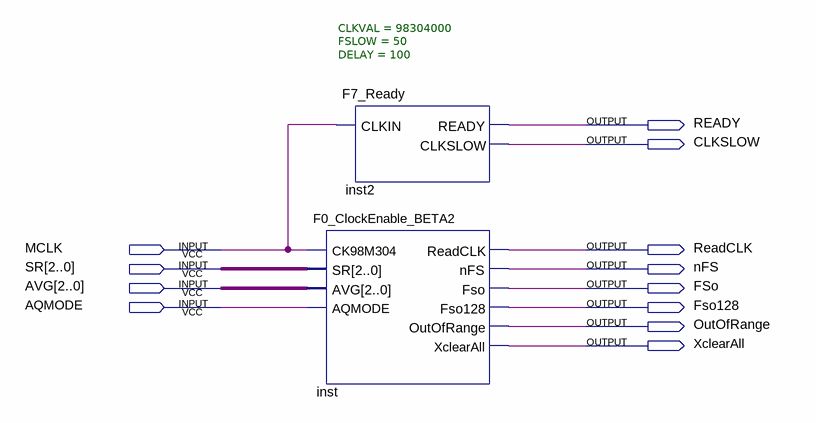
[diagram p0: schematic sheet]
// Quartus schematic TEST_Clocks_Modules.bdf as structural Verilog: 2 symbols, 12 pins
module TEST_Clocks_Modules (
  input  MCLK,
  input  [2:0] SR,
  input  [2:0] AVG,
  input  AQMODE,
  output READY,
  output CLKSLOW,
  output ReadCLK,
  output nFS,
  output FSo,
  output Fso128,
  output OutOfRange,
  output XclearAll
);

  F7_Ready #(.CLKVAL(98304000), .FSLOW(50), .DELAY(100)) inst2 (.CLKIN(MCLK), .READY(READY), .CLKSLOW(CLKSLOW));
  F0_ClockEnable_BETA2 inst (
    .CK98M304(MCLK), .SR(SR), .AVG(AVG), .AQMODE(AQMODE), .ReadCLK(ReadCLK), .nFS(nFS), .Fso(FSo),
    .Fso128(Fso128), .OutOfRange(OutOfRange), .XclearAll(XclearAll));
endmodule
